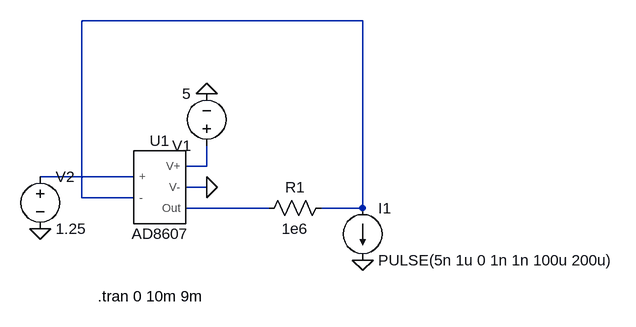
[diagram p0: schematic Photodiode simulation.asc]
Photodiode simulation.asc, the LTspice schematic file:
Version 4.1
SHEET 1 972 680
WIRE 560 -96 128 -96
WIRE 320 128 320 96
WIRE 320 128 288 128
WIRE 208 144 64 144
WIRE 320 160 288 160
WIRE 128 176 128 -96
WIRE 208 176 128 176
WIRE 416 192 288 192
WIRE 560 192 560 -96
WIRE 560 192 496 192
FLAG 320 16 0
FLAG 320 160 0
FLAG 560 272 0
FLAG 64 224 0
SYMBOL voltage 320 112 R180
WINDOW 123 0 0 Left 0
WINDOW 39 0 0 Left 0
SYMATTR InstName V1
SYMATTR Value 5
SYMBOL AD8607 240 160 R0
SYMATTR InstName U1
SYMBOL current 560 192 R0
WINDOW 123 0 0 Left 0
WINDOW 39 0 0 Left 0
SYMATTR InstName I1
SYMATTR Value PULSE(5n 1u 0 1n 1n 100u 200u)
SYMBOL res 512 176 R90
WINDOW 0 0 56 VBottom 2
WINDOW 3 32 56 VTop 2
SYMATTR InstName R1
SYMATTR Value 1e6
SYMBOL voltage 64 128 R0
WINDOW 123 0 0 Left 0
WINDOW 39 0 0 Left 0
SYMATTR InstName V2
SYMATTR Value 1.25
TEXT 152 328 Left 2 !.tran 0 10m 9m

The netlist it stands for:
* Photodiode simulation.asc
V1 N002 0 5
X§U1 N003 N001 N002 0 N004 AD8607  ; pins + - V+ V- Out
I1 N001 0 PULSE(5n 1u 0 1n 1n 100u 200u)
R1 N001 N004 1e6
V2 N003 0 1.25
.tran 0 10m 9m
.lib C:\Users\Ben\AppData\Local\LTspice\lib\sym\AutoGenerated\ad8607.cir
.backanno
.end